# Altium schematic sheet PAGE4 - BANK0 I_O.SchDoc
size 386 x 246 mm
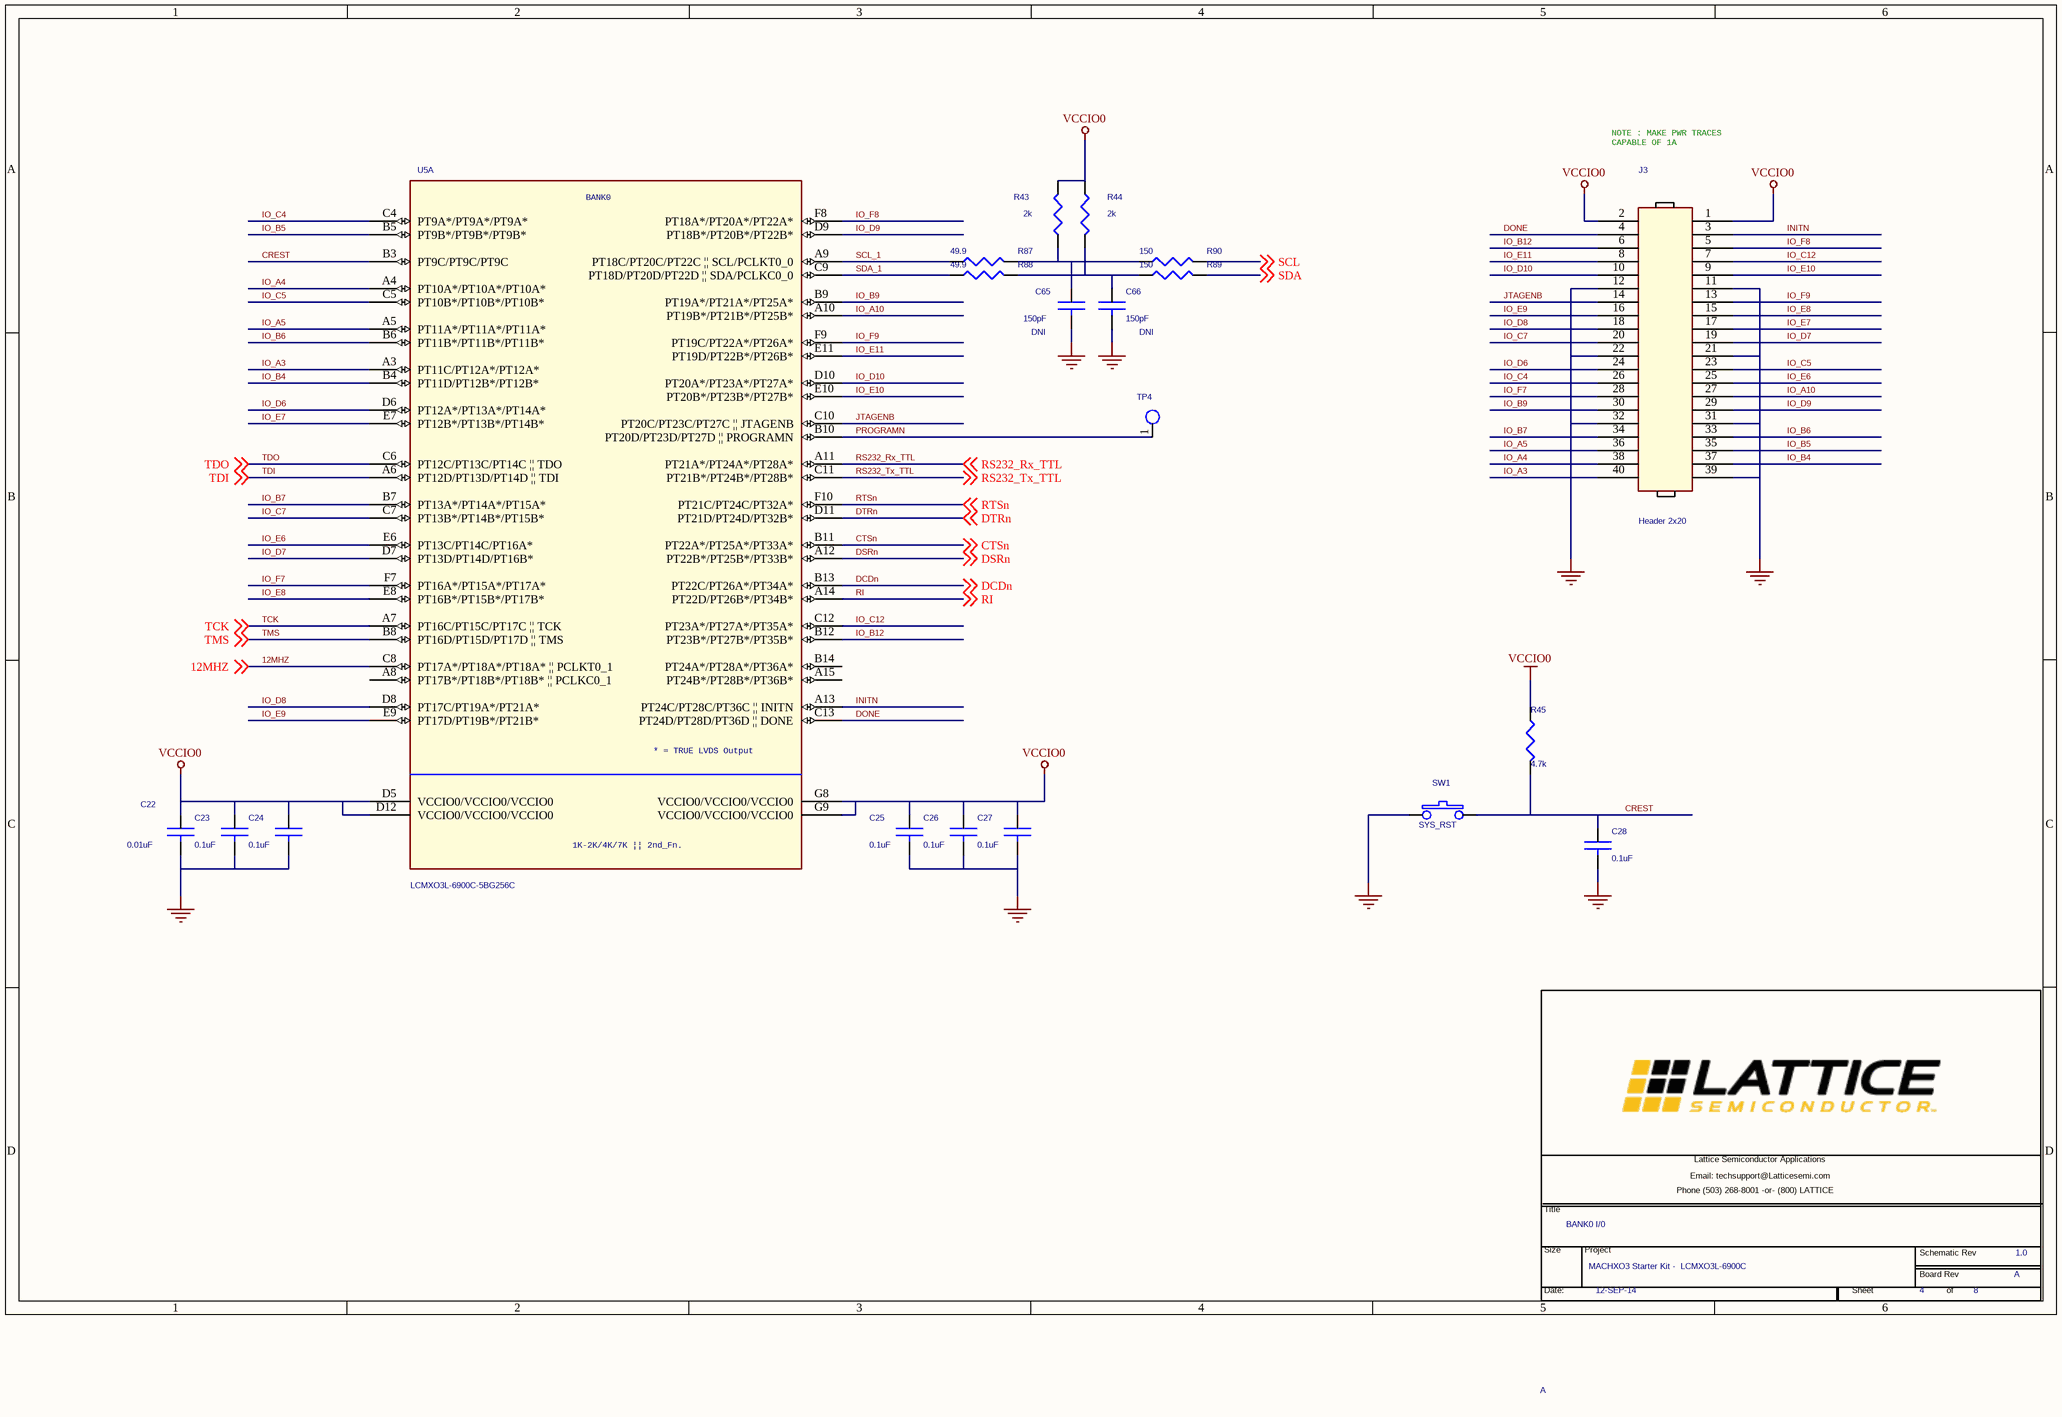
[diagram p0: PAGE4 - BANK0 I_O.SchDoc]

## Parts
*  Project Name: MACHXO3 Starter Kit -  LCMXO3L-6900C  Title: BANK0 I/0  Page Number: 4  Page Count: 8  RevCode: 1.0  Page Size: A  Date:: 12-SEP-14  (hidden comment: Lattice Title Block New Brand)  (graphical)
C22  0.01uF  [cc0402]
C23  0.1uF  [cc0402]
C24  0.1uF  [cc0402]
C25  0.1uF  [cc0402]
C26  0.1uF  [cc0402]
C27  0.1uF  [cc0402]
C28  0.1uF  [cc0402]
C65  150pF  Assy: DNI  [cc0402]
C66  150pF  Assy: DNI  [cc0402]
J3  Header 2x20  [hdr_samtec_mtsw_2x20_100]
R43  2k  [cr0402]
R44  2k  [cr0402]
R45  4.7k  [cr0402]
R87  49.9  [cr0603]
R88  49.9  [cr0603]
R89  150  [cr0603]
R90  150  [cr0603]
SW1  SYS_RST  [sw_sp_st_eswitch_tl1015]
TP4  tp_s_40_63  [tp_s_40_63]  (value not drawn)
U5  LCMXO3L-6900C-5BG256C  [bga256_0p8_14p0]  (part A of 7)

## Nets
GND: C22.2 C23.2 C24.2 C25.2 C26.2 C27.2 C28.2 C65.2 C66.2 J3.11 J3.12 J3.21 J3.22 J3.31 J3.32 J3.39 SW1.2
VCCIO0: C22.1 C23.1 C24.1 C25.1 C26.1 C27.1 J3.1 J3.2 R43.1 R44.1 R45.1 U5.D5(VCCIO0/VCCIO0/VCCIO0) U5.D12(VCCIO0/VCCIO0/VCCIO0) U5.G8(VCCIO0/VCCIO0/VCCIO0) U5.G9(VCCIO0/VCCIO0/VCCIO0)
12MHZ: U5.C8(PT17A*/PT18A*/PT18A*_||_PCLKT0_1) ; off-sheet 12MHZ
CREST: C28.1 R45.2 SW1.1 U5.B3(PT9C/PT9C/PT9C)
CTSn: U5.B11(PT22A*/PT25A*/PT33A*) ; off-sheet CTSn
DCDn: U5.B13(PT22C/PT26A*/PT34A*) ; off-sheet DCDn
DONE: J3.4 U5.C13(PT24D/PT28D/PT36D_||_DONE)
DSRn: U5.A12(PT22B*/PT25B*/PT33B*) ; off-sheet DSRn
DTRn: U5.D11(PT21D/PT24D/PT32B*) ; off-sheet DTRn
INITN: J3.3 U5.A13(PT24C/PT28C/PT36C_||_INITN)
IO_A3: J3.40 U5.A3(PT11C/PT12A*/PT12A*)
IO_A4: J3.38 U5.A4(PT10A*/PT10A*/PT10A*)
IO_A5: J3.36 U5.A5(PT11A*/PT11A*/PT11A*)
IO_A10: J3.27 U5.A10(PT19B*/PT21B*/PT25B*)
IO_B4: J3.37 U5.B4(PT11D/PT12B*/PT12B*)
IO_B5: J3.35 U5.B5(PT9B*/PT9B*/PT9B*)
IO_B6: J3.33 U5.B6(PT11B*/PT11B*/PT11B*)
IO_B7: J3.34 U5.B7(PT13A*/PT14A*/PT15A*)
IO_B9: J3.30 U5.B9(PT19A*/PT21A*/PT25A*)
IO_B12: J3.6 U5.B12(PT23B*/PT27B*/PT35B*)
IO_C4: J3.26 U5.C4(PT9A*/PT9A*/PT9A*)
IO_C5: J3.23 U5.C5(PT10B*/PT10B*/PT10B*)
IO_C7: J3.20 U5.C7(PT13B*/PT14B*/PT15B*)
IO_C12: J3.7 U5.C12(PT23A*/PT27A*/PT35A*)
IO_D6: J3.24 U5.D6(PT12A*/PT13A*/PT14A*)
IO_D7: J3.19 U5.D7(PT13D/PT14D/PT16B*)
IO_D8: J3.18 U5.D8(PT17C/PT19A*/PT21A*)
IO_D9: J3.29 U5.D9(PT18B*/PT20B*/PT22B*)
IO_D10: J3.10 U5.D10(PT20A*/PT23A*/PT27A*)
IO_E6: J3.25 U5.E6(PT13C/PT14C/PT16A*)
IO_E7: J3.17 U5.E7(PT12B*/PT13B*/PT14B*)
IO_E8: J3.15 U5.E8(PT16B*/PT15B*/PT17B*)
IO_E9: J3.16 U5.E9(PT17D/PT19B*/PT21B*)
IO_E10: J3.9 U5.E10(PT20B*/PT23B*/PT27B*)
IO_E11: J3.8 U5.E11(PT19D/PT22B*/PT26B*)
IO_F7: J3.28 U5.F7(PT16A*/PT15A*/PT17A*)
IO_F8: J3.5 U5.F8(PT18A*/PT20A*/PT22A*)
IO_F9: J3.13 U5.F9(PT19C/PT22A*/PT26A*)
JTAGENB: J3.14 U5.C10(PT20C/PT23C/PT27C_||_JTAGENB)
PROGRAMN: TP4.1(TP) U5.B10(PT20D/PT23D/PT27D_||_PROGRAMN)
RI: U5.A14(PT22D/PT26B*/PT34B*) ; off-sheet RI
RS232_Rx_TTL: U5.A11(PT21A*/PT24A*/PT28A*) ; off-sheet RS232_Rx_TTL
RS232_Tx_TTL: U5.C11(PT21B*/PT24B*/PT28B*) ; off-sheet RS232_Tx_TTL
RTSn: U5.F10(PT21C/PT24C/PT32A*) ; off-sheet RTSn
SCL: R90.2 ; off-sheet SCL
SCL_1: R87.1 U5.A9(PT18C/PT20C/PT22C_||_SCL/PCLKT0_0)
SDA: R89.2 ; off-sheet SDA
SDA_1: R88.1 U5.C9(PT18D/PT20D/PT22D_||_SDA/PCLKC0_0)
TCK: U5.A7(PT16C/PT15C/PT17C_||_TCK) ; off-sheet TCK
TDI: U5.A6(PT12D/PT13D/PT14D_||_TDI) ; off-sheet TDI
TDO: U5.C6(PT12C/PT13C/PT14C_||_TDO) ; off-sheet TDO
TMS: U5.B8(PT16D/PT15D/PT17D_||_TMS) ; off-sheet TMS
NetC65_1: C65.1 R43.2 R87.2 R90.1
NetC66_1: C66.1 R44.2 R88.2 R89.1

Not connected (* = marked no-connect by the designer): U5 A8(PT17B*/PT18B*/PT18B*_||_PCLKC0_1) A15(PT24B*/PT28B*/PT36B*) B14(PT24A*/PT28A*/PT36A*)

## Notes on the sheet
- NOTE : MAKE PWR TRACES
  CAPABLE OF 1A
- (in symbol Lattice Title Block New Brand) Lattice Semiconductor Applications; Email: techsupport@Latticesemi.com; Phone (503) 268-8001 -or- (800) LATTICE; Title; Size; Project; Schematic Rev; Board Rev; Date:; Sheet; of
- (in symbol LCMXO3L-1K/2K/4K/7K-BG256, part A) BANK0; * = TRUE LVDS Output; 1K-2K/4K/7K || 2nd_Fn.

## Library data of the parts
C22 = 0_01uF_0402: CAP CER 10000PF 16V 5% X7R 0402; Manufacturer Part Number: C0402C103J4RACTU; Manufacturer: Kemet; Class: Discrete; Digikey P/N: 399-1039-1-ND
C23-C28 C65 C66 = 0u1_0402: CAP CER 0.1UF 16V 10% X7R 0402; Manufacturer Part Number: C0402C104K4RACTU; Manufacturer: Kemet; Class: Discrete; Digikey P/N: 399-3521-2-ND
J3 = HEADER 20X2: CONN HEADER 40POS .100" DL GOLD; Manufacturer Part Number: TSW-120-07-G-D; Manufacturer: Samtec; ASSY: DNI; Digikey P/N: SAM1028-20-ND
R43 R44 = 5k1_0402: RES 2.0K OHM 1/10W 5% 0603 SMD; Manufacturer: Vishay; Manufacturer Part Number: CRCW06032K00JNEA; Class: Discrete; Digikey P/N: 541-2.0KGTR-ND
R45 = 5k1_0402: RES 4.70K OHM 1/10W 1% 0603 SMD; Manufacturer: Vishay; Manufacturer Part Number: CRCW06034K70FKEA; Class: Discrete; Digikey P/N: 541-4.70KHTR-ND
R87 R88 = 0R_0603: RES 49.9 OHM 1/10W 1% 0603 SMD; Manufacturer Part Number: CRCW060349R9FKEA; Manufacturer: Vishay; Class: Discrete; Digikey P/N: 541-49.9HTR-ND
R89 R90 = 0R_0603: RES 150 OHM 1/10W 5% 0603 SMD; Manufacturer Part Number: CRCW0603150RJNEA; Manufacturer: Vishay; Class: Discrete; Digikey P/N: 541-150GTR-ND
SW1 = SW PUSHBUTTON-SPST/SM: SWITCH TACTILE SPST-NO 0.05A 12V; Manufacturer: E-Switch; MFG P/N: TL1015AF160QG; MFG: E-Switch Inc; Man. Part #: TL1015AF160QG; Manufacturer Part Number: TL1015AF160QG; Digikey P/N: EG4344TR-ND
TP4 = TP_S_40_63: Square test point, 40mil inner diameter, 63mil outer diameter; Assy: DNI; Class: IO
U5 = LCMXO3L-1K/2K/4K/7K-BG256: IC FPGA 6864LUTS 256BGA; Manufacturer: Lattice semi; SPLIT_INST: TRUE; SWAP_INFO: (S1+S2+S3+S4+S5+S6+S7); Manufacturer Part Number: LCMXO3L-6900C-5BG256C; Digikey P/N: 220-1886-ND
* = Lattice Title Block New Brand: Board Rev: A